# Altium schematic sheet SPDIF-RX.SchDoc
size A3
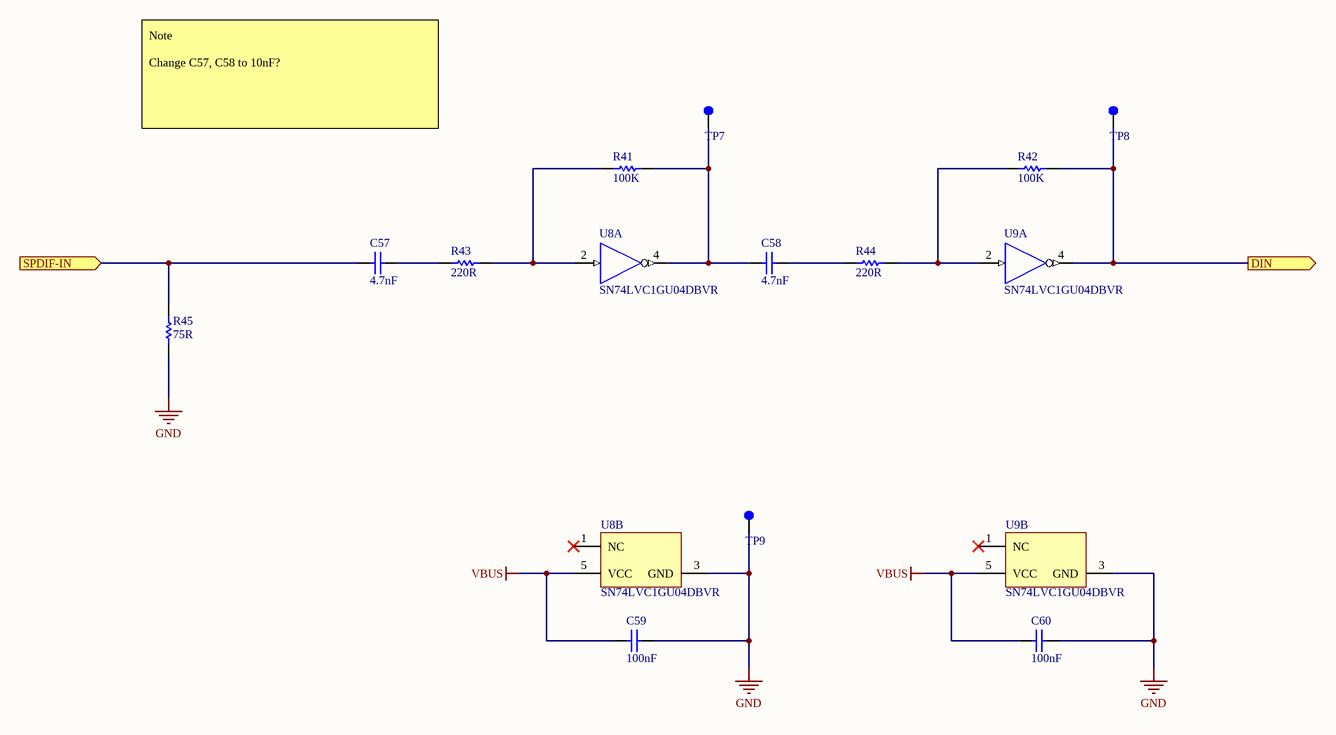
[diagram p0: SPDIF-RX.SchDoc]

## Parts
C57  value 4.7nF  [CAPC0402(1005)33_L]  (hidden comment: GRM155R71H472KA01D)
C58  value 4.7nF  [CAPC0402(1005)33_L]  (hidden comment: GRM155R71H472KA01D)
C59  value 100nF  [CAPC0402(1005)33_L]  (hidden comment: GRM155R61C104KA88D)
C60  value 100nF  [CAPC0402(1005)33_L]  (hidden comment: GRM155R61C104KA88D)
R41  100K  [RESC0402(1005)_L]
R42  100K  [RESC0402(1005)_L]
R43  220R  [RESC0402(1005)_L]
R44  220R  [RESC0402(1005)_L]
R45  75R  [RESC0805(2012)_L]
TP7  MECH_Testpoint  [MECH_TP_39_mil]  (value not drawn)  (no BOM)
TP8  MECH_Testpoint  [MECH_TP_39_mil]  (value not drawn)  (no BOM)
TP9  MECH_Testpoint  [MECH_TP_39_mil]  (value not drawn)  (no BOM)
U8  SN74LVC1GU04DBVR  [DBV0005A_N]  (parts A,B of 2)
U9  SN74LVC1GU04DBVR  [DBV0005A_N]  (parts A,B of 2)

## Ports
DIN (out), SPDIF-IN (in)

## Nets
GND: C59.2 C60.2 R45.1 TP9.1(Pin1) U8.3(GND) U9.3(GND)
VBUS: C59.1 C60.1 U8.5(VCC) U9.5(VCC)
DIN: R42.2 TP8.1(Pin1) U9.4(Y) ; port DIN
SPDIF-IN: C57.1 R45.2 ; port SPDIF-IN
NetC57_2: C57.2 R43.1
NetC58_1: C58.1 R41.2 TP7.1(Pin1) U8.4(Y)
NetC58_2: C58.2 R44.1
NetR41_1: R41.1 R43.2 U8.2(A)
NetR42_1: R42.1 R44.2 U9.2(A)

Not connected (* = marked no-connect by the designer): U8 1(NC)*; U9 1(NC)*

## Notes on the sheet
- Note
  Change C57, C58 to 10nF?

## Library data of the parts
C57 C58 = CAP_4.7nF_0402: 0402 4.7nF ±10% 50V X7R; PackageReference: 0402; MPN: GRM155R71H472KA01D; Voltage: 50V; Dielectric: X7R
C59 C60 = CAP_100nF_0402: 0402 100nF ±10% 16V X5R; PackageReference: 0402; MPN: GRM155R61C104KA88D; Voltage: 16V; Dielectric: X5R
R41 R42 = RES_100K_0402: 0402 100KΩ ±1% 1/16W; MPN: RC0402FR-07100KL; Power: 62.5mW; Tolerance: 1%; Value: 100K
R43 R44 = RES_220R_0402: 0402 220Ω ±1% 1/16W; MPN: RC0402FR-07220RL; Power: 62.5mW; Tolerance: 1%; Value: 220R
R45 = RES_75R_0805: 0805 75Ω ±1% 1/8W; MPN: RC0805FR-0775RL; Power: 62.5mW; Tolerance: 1%; Value: 75R
TP7-TP9 = MECH_Testpoint: Testpoint
U8 U9 = CMP-0859-00178-1: Single Inverter Gate, DBV0005A, LARGE T&R; Logic: Inverting; Schmitt Trigger: No; Technology Family: LVC; ICC @ Nom Voltage(Max)(mA): 0.01; Rating: Catalog; Output Drive (IOL/IOH)(Max)(mA): 32/-32; VCC(Min)(V): 1.65; Voltage(Nom)(V): 1.8,2.5,3.3,5; tpd @ Nom Voltage(Max)(ns): 5.5,4.5,4.2,3.5; Sub-Family: Inverting Buffer/Driver; VCC(Max)(V): 5.5; F @ Nom Voltage(Max)(Mhz): 150; Output Type: CMOS; Input Type: CMOS/TTL; Bits(#): 1; PackageReference: DBV0005A; ComponentLink1URL: http://www.ti.com/; ComponentLink2Description: Datasheet; PartNumber: SN74LVC1GU04DBVR; ComponentLink2URL: http://www.ti.com/lit/ds/symlink/sn74lvc1gu04.pdf; 3-State Output: No; DatasheetVersion: SCES215V; Part Number: SN74LVC1GU04; ComponentLink1Description: Manufacturer URL; Operating Temperature Range(C): -40 to 125,-40 to 85; PartId: 1; MPN: SN74LVC1GU04DBVR